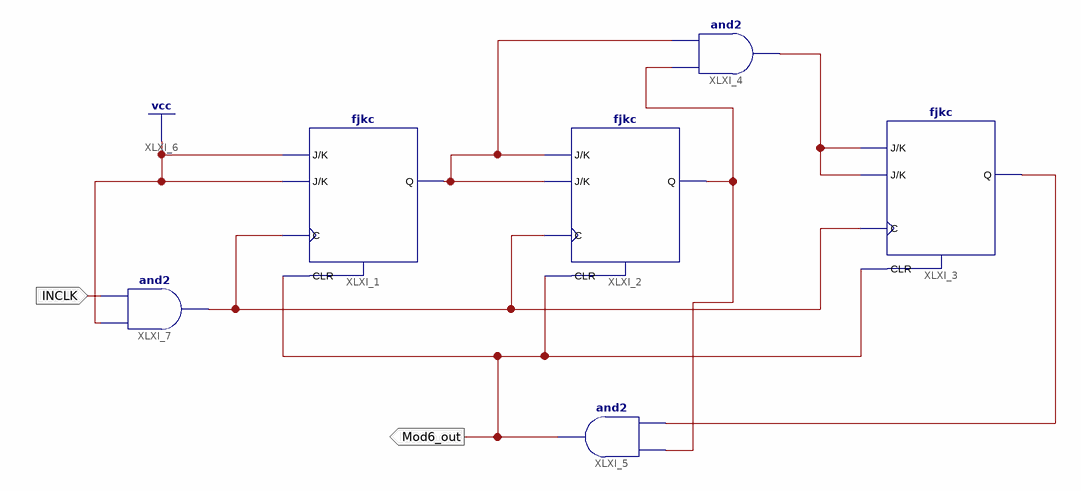
[diagram p0: schematic sheet 1]
// Xilinx ISE schematic counter1_5.sch (spartan6) as structural Verilog: 6 symbols, 2 ports
module counter1_5 (
  input  INCLK,
  output Mod6_out
);

  wire XLXN_3, XLXN_4, XLXN_5, XLXN_9, XLXN_11;

  fjkc XLXI_1 (.C(XLXN_9), .CLR(Mod6_out), .J(1'b1), .K(1'b1), .Q(XLXN_3));
  fjkc XLXI_2 (.C(XLXN_9), .CLR(Mod6_out), .J(XLXN_3), .K(XLXN_3), .Q(XLXN_4));
  fjkc XLXI_3 (.C(XLXN_9), .CLR(Mod6_out), .J(XLXN_5), .K(XLXN_5), .Q(XLXN_11));
  and XLXI_4 (XLXN_5, XLXN_4, XLXN_3);
  and XLXI_5 (Mod6_out, XLXN_11, XLXN_4);
  and XLXI_7 (XLXN_9, 1'b1, INCLK);
endmodule
